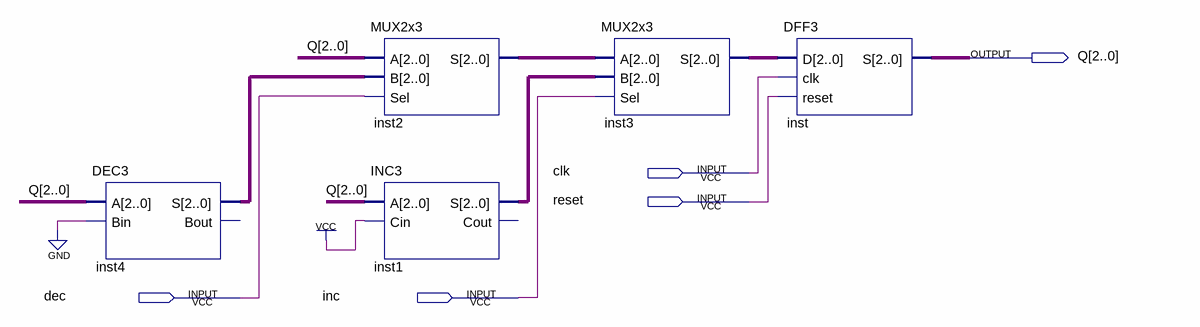
[diagram p0: schematic sheet]
// Quartus schematic CUD3.bdf as structural Verilog: 5 symbols, 5 pins
module CUD3 (
  input  clk,
  input  reset,
  input  dec,
  input  inc,
  output [2:0] Q
);

  wire [2:0] inst1_s, inst2_s, inst3_s, inst4_s;

  DEC3 inst4 (.A(Q), .Bin(1'b0), .S(inst4_s));  // open: Bout
  MUX2x3 inst2 (.A(Q), .B(inst4_s), .Sel(dec), .S(inst2_s));
  INC3 inst1 (.A(Q), .Cin(1'b1), .S(inst1_s));  // open: Cout
  MUX2x3 inst3 (.A(inst2_s), .B(inst1_s), .Sel(inc), .S(inst3_s));
  DFF3 inst (.D(inst3_s), .clk(clk), .reset(reset), .S(Q));
endmodule
